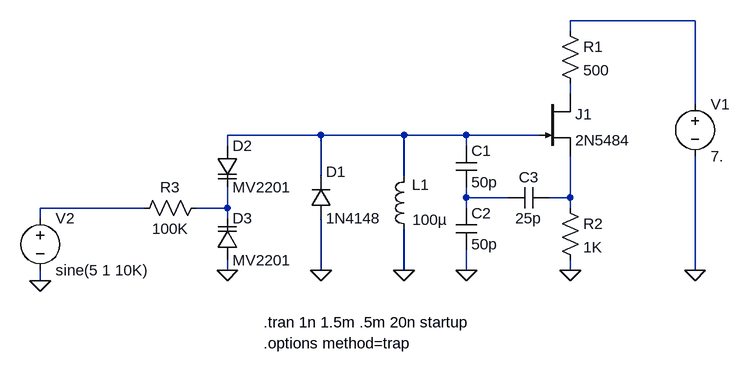
[diagram p0: schematic VCO.asc]
VCO.asc, the LTspice schematic file:
Version 4
SHEET 1 2460 2384
WIRE 2400 1872 2208 1872
WIRE 2208 1888 2208 1872
WIRE 2208 1984 2208 1968
WIRE 2400 2000 2400 1872
WIRE 1824 2048 1680 2048
WIRE 1952 2048 1824 2048
WIRE 2048 2048 1952 2048
WIRE 2160 2048 2048 2048
WIRE 1680 2064 1680 2048
WIRE 2048 2064 2048 2048
WIRE 1824 2112 1824 2048
WIRE 1952 2112 1952 2048
WIRE 2048 2144 2048 2128
WIRE 2112 2144 2048 2144
WIRE 2208 2144 2208 2080
WIRE 2208 2144 2176 2144
WIRE 1552 2160 1392 2160
WIRE 1680 2160 1680 2128
WIRE 1680 2160 1632 2160
WIRE 2048 2160 2048 2144
WIRE 2208 2160 2208 2144
WIRE 1392 2176 1392 2160
WIRE 1680 2176 1680 2160
WIRE 1680 2256 1680 2240
WIRE 1824 2256 1824 2176
WIRE 1952 2256 1952 2192
WIRE 2048 2256 2048 2224
WIRE 2208 2256 2208 2240
WIRE 2400 2256 2400 2080
WIRE 1392 2272 1392 2256
FLAG 1952 2256 0
FLAG 2048 2256 0
FLAG 2208 2256 0
FLAG 2400 2256 0
FLAG 1824 2256 0
FLAG 1680 2256 0
FLAG 1392 2272 0
SYMBOL NJF 2160 1984 R0
SYMATTR InstName J1
SYMATTR Value 2N5484
SYMBOL RES 2192 1872 R0
SYMATTR InstName R1
SYMATTR Value 500
SYMBOL res 2192 2144 R0
SYMATTR InstName R2
SYMATTR Value 1K
SYMBOL ind 1968 2208 R180
WINDOW 0 4 84 Right 2
WINDOW 3 3 30 Right 2
SYMATTR InstName L1
SYMATTR Value 100µ
SYMBOL cap 2032 2064 R0
SYMATTR InstName C1
SYMATTR Value 50p
SYMBOL cap 2032 2160 R0
SYMATTR InstName C2
SYMATTR Value 50p
SYMBOL cap 2176 2128 R90
WINDOW 0 0 32 VBottom 2
WINDOW 3 32 32 VTop 2
SYMATTR InstName C3
SYMATTR Value 25p
SYMBOL VOLTAGE 2400 1984 R0
SYMATTR InstName V1
SYMATTR Value 7.
SYMBOL diode 1808 2176 M180
WINDOW 0 24 72 Left 2
WINDOW 3 24 0 Left 2
SYMATTR InstName D1
SYMATTR Value 1N4148
SYMBOL varactor 1664 2064 R0
SYMATTR InstName D2
SYMATTR Value MV2201
SYMBOL varactor 1664 2240 M180
WINDOW 0 24 64 Left 2
WINDOW 3 24 0 Left 2
SYMATTR InstName D3
SYMATTR Value MV2201
SYMBOL res 1648 2144 R90
WINDOW 0 0 56 VBottom 2
WINDOW 3 32 56 VTop 2
SYMATTR InstName R3
SYMATTR Value 100K
SYMBOL voltage 1392 2160 R0
SYMATTR InstName V2
SYMATTR Value sine(5 1 10K)
TEXT 1736 2336 Left 2 !.tran 1n 1.5m .5m 20n startup
TEXT 1736 2368 Left 2 !.options method=trap

The netlist it stands for:
* VCO.asc
J1 N002 N003 N005 2N5484
R1 N001 N002 500
R2 N005 0 1K
L1 0 N003 100µ
C1 N003 N004 50p
C2 N004 0 50p
C3 N005 N004 25p
V1 N001 0 7.
D1 0 N003 1N4148
D2 N003 N007 MV2201
D3 0 N007 MV2201
R3 N007 N006 100K
V2 N006 0 sine(5 1 10K)
.model D D
.lib standard.dio
.model NJF NJF
.model PJF PJF
.lib standard.jft
.tran 1n 1.5m .5m 20n startup
.options method=trap
.backanno
.end